# EAGLE design analogBoardV1_5 (EAGLE 6.4)
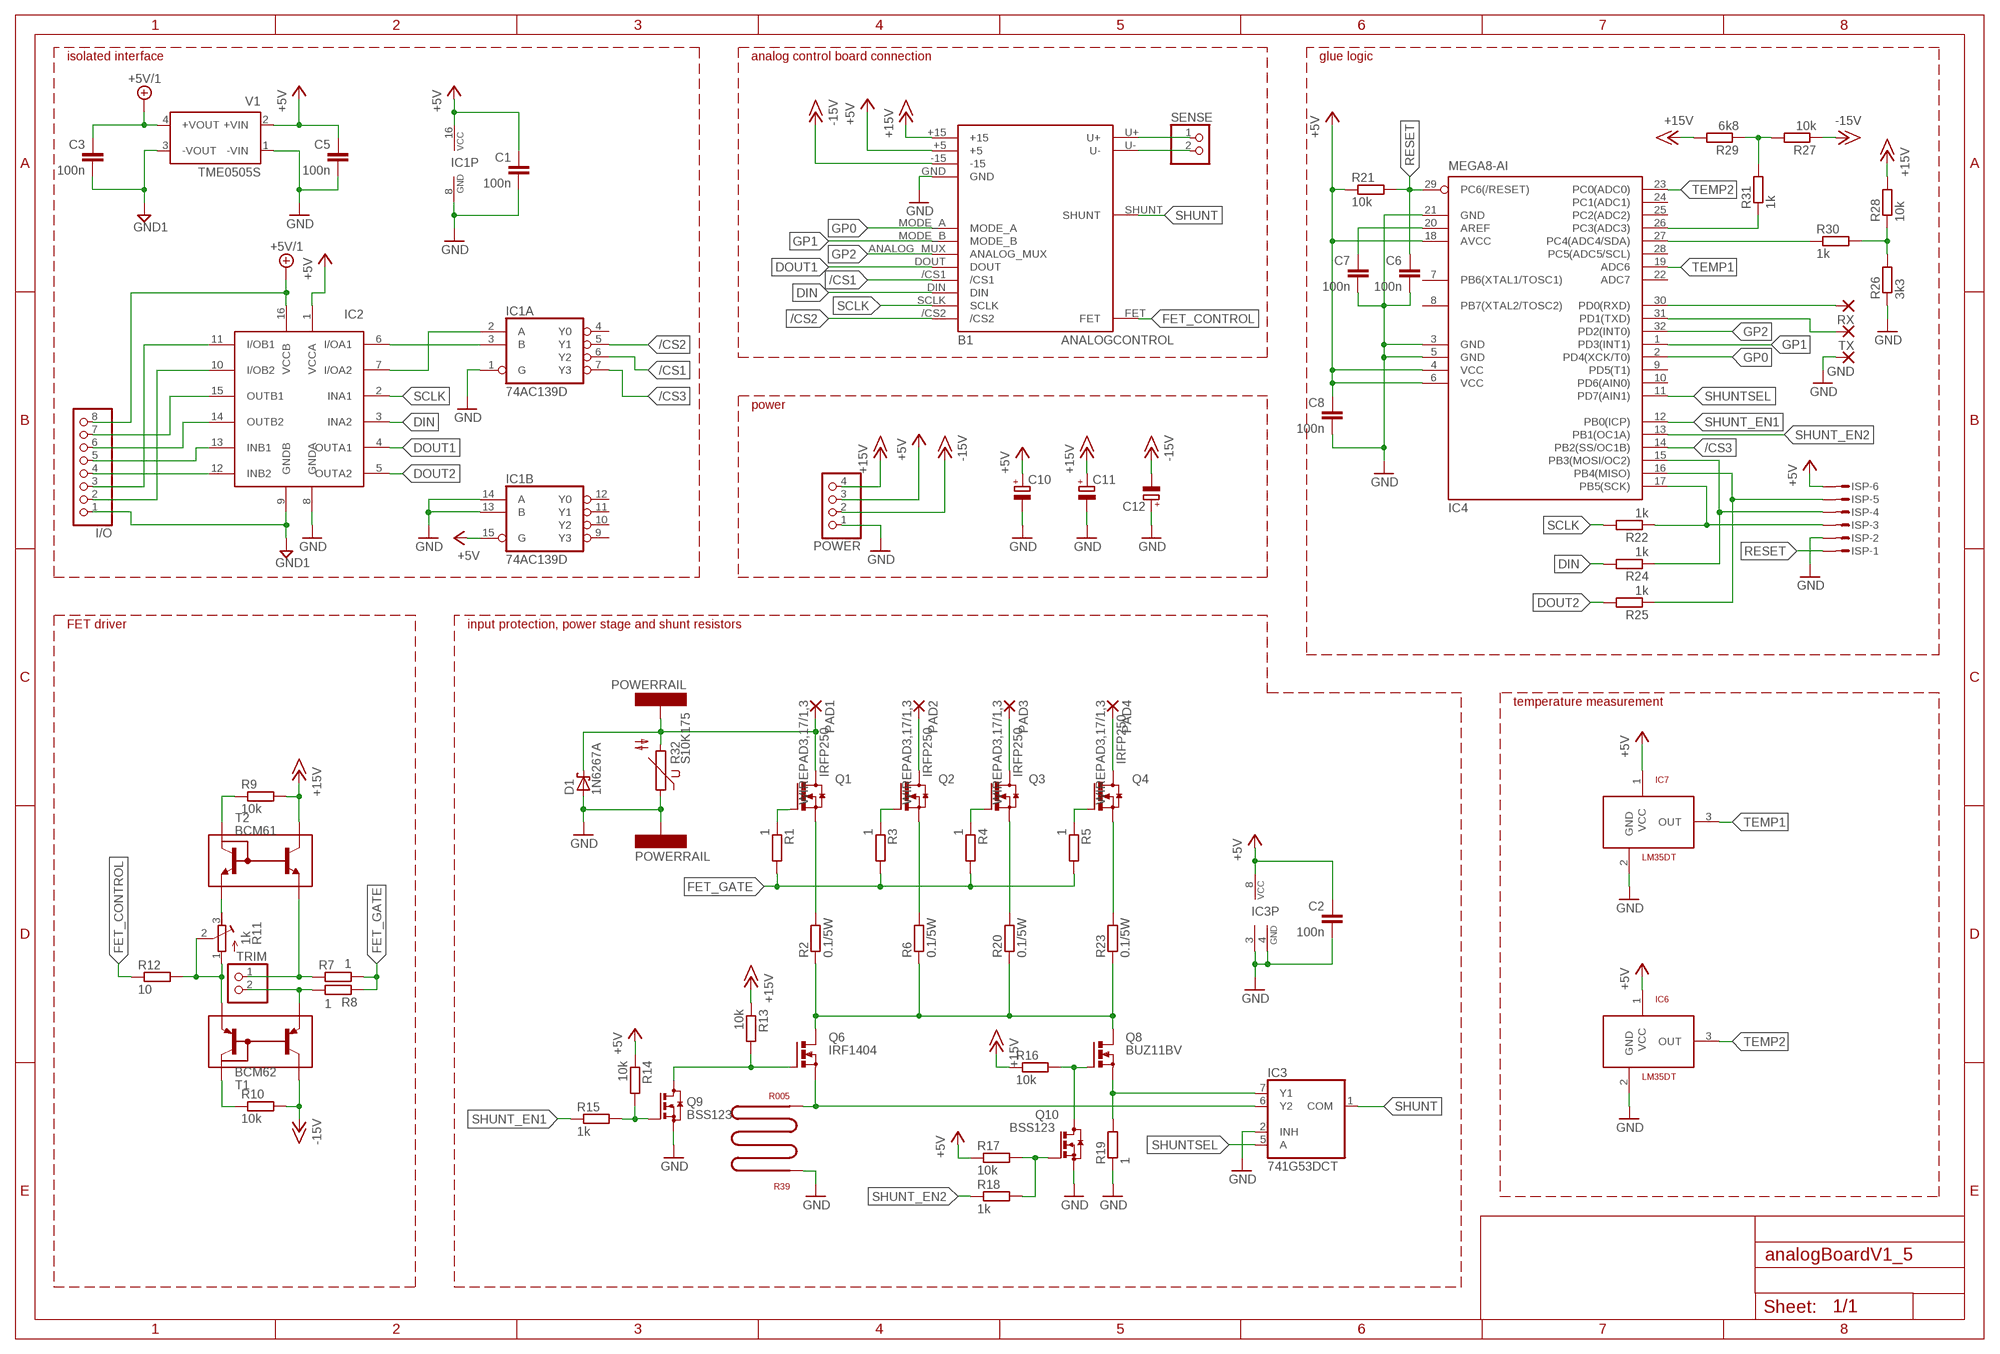
[diagram p0: schematic, sheet 1]

## Parts
B1  ANALOGCONTROL  [ANALOGCONTROL]
C1  100n  C-EUC0603K  [C0603K]
C2  100n  C-EUC0603K  [C0603K]
C3  100n  C-EUC0603K  [C0603K]
C5  100n  C-EUC0603K  [C0603K]
C6  100n  C-EUC0603K  [C0603K]
C7  100n  C-EUC0603K  [C0603K]
C8  100n  C-EUC0603K  [C0603K]
C10  CPOL-EUE2.5-6  [E2,5-6]
C11  CPOL-EUE2.5-6  [E2,5-6]
C12  CPOL-EUE2.5-6  [E2,5-6]
D1  1N6267A  [C4111-15]
GND  SMD2  [SMD1,27-2,54]
I/O  PINHD-1X8  [1X08]
IC1  74AC139D  [SO16]
IC2  MAX14850  [SOIC16N]
IC3  741G53DCT  [DCT_R-PDSO-G8]
IC4  MEGA8-AI  [TQFP32-08]
IC6  LM35DT  [TO220V]
IC7  LM35DT  [TO220V]
ISP  MICROMATCH-6SMF  [MMT-F-SMD-6]
PAD1  WIREPAD3,17/1,3  [3,17/1,3]
PAD2  WIREPAD3,17/1,3  [3,17/1,3]
PAD3  WIREPAD3,17/1,3  [3,17/1,3]
PAD4  WIREPAD3,17/1,3  [3,17/1,3]
POWER  PINHD-1X4  [1X04]
Q1  IRFP250  [TO-247AD-V]
Q2  IRFP250  [TO-247AD-V]
Q3  IRFP250  [TO-247AD-V]
Q4  IRFP250  [TO-247AD-V]
Q6  IRF1404  BUZ11BV  [TO220BV]
Q8  BUZ11BV  [TO220BV]
Q9  BSS123  [SOT23]
Q10  BSS123  [SOT23]
R1  1  R-EU_R0603  [R0603]
R2  0.1/5W  5WAXIALH  [5WAXIAL_H]
R3  1  R-EU_R0603  [R0603]
R4  1  R-EU_R0603  [R0603]
R5  1  R-EU_R0603  [R0603]
R6  0.1/5W  5WAXIALH  [5WAXIAL_H]
R7  1  R-EU_R0603  [R0603]
R8  1  R-EU_R0603  [R0603]
R9  10k  R-EU_R0603  [R0603]
R10  10k  R-EU_R0603  [R0603]
R11  1k  R-TRIMM64W  [RTRIM64W]
R12  10  R-EU_R0603  [R0603]
R13  10k  R-EU_R0603  [R0603]
R14  10k  R-EU_R0603  [R0603]
R15  1k  R-EU_R0603  [R0603]
R16  10k  R-EU_R0603  [R0603]
R17  10k  R-EU_R0603  [R0603]
R18  1k  R-EU_R0603  [R0603]
R19  1  R-EU_0414/15  [0414/15]
R20  0.1/5W  5WAXIALH  [5WAXIAL_H]
R21  10k  R-EU_R0603  [R0603]
R22  1k  R-EU_R0603  [R0603]
R23  0.1/5W  5WAXIALH  [5WAXIAL_H]
R24  1k  R-EU_R0603  [R0603]
R25  1k  R-EU_R0603  [R0603]
R26  3k3  R-EU_R0603  [R0603]
R27  10k  R-EU_R0603  [R0603]
R28  10k  R-EU_R0603  [R0603]
R29  6k8  R-EU_R0603  [R0603]
R30  1k  R-EU_R0603  [R0603]
R31  1k  R-EU_R0603  [R0603]
R32  S10K175  [S10K175]
R39  R005  SHUNTPWR  [PWR4412-2S]
RX  SMD2  [SMD1,27-2,54]
SENSE  PINHD-1X2  [1X02]
T1  BCM62  [SOT143B]
T2  BCM61  [SOT143B]
TRIM  PINHD-1X2  [1X02]
TX  SMD2  [SMD1,27-2,54]
U$1  POWERRAIL  [POWERRAIL]
U$2  POWERRAIL  [POWERRAIL]
V1  TME0505S  [TME]

## Nets
+5V: B1.+5 C1.1 C2.1 C5.1 C8.1 C10.+ IC1.15(B:G) IC1.16(P:VCC) IC2.1(VCCA) IC3.8(VCC) IC4.4(VCC) IC4.6(VCC) IC4.18(AVCC) IC6.1(VCC) IC7.1(VCC) ISP.6 POWER.3 R14.1 R17.1 R21.1 V1.2(+VIN)
+5V/1: C3.1 I/O.8 IC2.16(VCCB) V1.4(+VOUT)
+15V: B1.+15 C11.+ POWER.4 R9.2 R13.1 R16.1 R28.2 R29.2 T2.2
-15V: B1.-15 C12.- POWER.2 R10.2 R27.1 T1.2
/CS1: B1./CS1 IC1.6(A:Y2)
/CS2: B1./CS2 IC1.5(A:Y1)
/CS3: IC1.7(A:Y3) IC4.14(PB2(SS/OC1B))
DIN: B1.DIN IC2.3(INA2) R24.2
DOUT1: B1.DOUT IC2.4(OUTA1)
DOUT2: IC2.5(OUTA2) R25.2
FET_CONTROL: B1.FET R12.1
FET_GATE: R1.2 R3.2 R4.2 R5.2 R7.2 R8.1
GND: B1.GND C1.2 C2.2 C5.2 C6.2 C7.2 C8.2 C10.- C11.- C12.+ D1.A GND.1(P) IC1.1(A:G) IC1.8(P:GND) IC1.13(B:B) IC1.14(B:A) IC2.8(GNDA) IC3.2(INH) IC3.3(GND) IC3.4(GND) IC4.3(GND) IC4.5(GND) IC4.21(GND) IC6.2(GND) IC7.2(GND) ISP.2 POWER.1 Q9.2(S) Q10.2(S) R19.1 R26.1 R32.1 R39.P$1 U$2.1 V1.1(-VIN)
GND1: C3.2 I/O.1 IC2.9(GNDB) V1.3(-VOUT)
GP0: B1.MODE_A IC4.2(PD4(XCK/T0))
GP1: B1.MODE_B IC4.1(PD3(INT1))
GP2: B1.ANALOG_MUX IC4.32(PD2(INT0))
N: Q6.D Q8.D R2.1 R6.1 R20.1 R23.1
N$1: R9.1 T2.1
N$2: Q1.G R1.1
N$3: Q1.S R2.2
N$4: Q4.G R5.1
N$5: Q3.G R4.1
N$6: Q2.G R3.1
N$7: I/O.4 IC2.12(INB2)
N$8: Q2.S R6.2
N$10: R7.1 T2.3 TRIM.1
N$11: R8.2 T1.3 TRIM.2
N$12: R10.1 T1.1
N$13: I/O.5 IC2.13(INB1)
N$14: R11.3(A) T2.4
N$15: I/O.6 IC2.14(OUTB2)
N$16: I/O.7 IC2.15(OUTB1)
N$17: B1.U+ SENSE.1
N$18: Q6.G Q9.3(D) R13.2
N$19: Q3.S R20.2
N$20: R11.1(E) R11.2(S) R12.2 T1.4
N$21: IC1.3(A:B) IC2.6(I/OA1)
N$22: Q9.1(G) R14.2 R15.2
N$23: Q8.G Q10.3(D) R16.2
N$24: Q10.1(G) R17.2 R18.2
N$25: PAD2.1(P) Q2.D
N$26: IC1.2(A:A) IC2.7(I/OA2)
N$27: Q4.S R23.2
N$28: I/O.3 IC2.11(I/OB1)
N$29: I/O.2 IC2.10(I/OB2)
N$30: PAD3.1(P) Q3.D
N$31: C7.1 IC4.20(AREF)
N$32: IC4.30(PD0(RXD)) RX.1(P)
N$33: IC4.31(PD1(TXD)) TX.1(P)
N$34: R26.2 R28.1 R30.2
N$35: R27.2 R29.1 R31.2
N$36: IC4.27(PC4(ADC4/SDA)) R30.1
N$37: IC4.26(PC3(ADC3)) R31.1
N$38: B1.U- SENSE.2
N$63: IC4.15(PB3(MOSI/OC2)) ISP.4 R24.1
N$64: IC4.17(PB5(SCK)) ISP.3 R22.1
N$66: IC4.16(PB4(MISO)) ISP.5 R25.1
POS_INPUT1: PAD4.1(P) Q4.D
RESET: C6.1 IC4.29(PC6(/RESET)) ISP.1 R21.2
SCLK: B1.SCLK IC2.2(INA1) R22.2
SHUNT: B1.SHUNT IC3.1(COM)
SHUNT1: IC3.6(Y2) Q6.S R39.P$2
SHUNT2: IC3.7(Y1) Q8.S R19.2
SHUNT_EN1: IC4.12(PB0(ICP)) R15.1
SHUNT_EN2: IC4.13(PB1(OC1A)) R18.1
SHUNTSEL: IC3.5(A) IC4.11(PD7(AIN1))
TEMP1: IC4.19(ADC6) IC7.3(OUT)
TEMP2: IC4.23(PC0(ADC0)) IC6.3(OUT)
VIN: D1.C PAD1.1(P) Q1.D R32.2 U$1.1
Unconnected: IC1.4(A:Y0) IC1.9(B:Y3) IC1.10(B:Y2) IC1.11(B:Y1) IC1.12(B:Y0) IC4.7(PB6(XTAL1/TOSC1)) IC4.8(PB7(XTAL2/TOSC2)) IC4.9(PD5(T1)) IC4.10(PD6(AIN0)) IC4.22(ADC7) IC4.24(PC1(ADC1)) IC4.25(PC2(ADC2)) IC4.28(PC5(ADC5/SCL))

## Notes on the sheet
- isolated interface | analog control board connection | glue logic
- power
- FET driver | input protection, power stage and shunt resistors
- temperature measurement

## Library data of the parts
B1 = load:ANALOGCONTROL
C1-C3 C5-C8 = rcl:C-EU: CAPACITOR, European symbol
C10-C12 = rcl:CPOL-EU: POLARIZED CAPACITOR, European symbol
D1 = diode:1N6267A: DIODE transient voltage suppressor
GND RX TX = wirepad:SMD2: SMD PAD
I/O = pinhead:PINHD-1X8: PIN HEADER
IC1 = 74xx-eu:74*139: Dual 2-line to 4-line DECODER/DEMULTIPLEXER
IC2 = load:MAX14850
IC3 = 74xx-little-us:74*1G53: SINGLE-POLE DOUBLE-THROW (SPDT) ANALOG SWITCH 2:1 ANALOG MULTIPLEXER/DEMULTIPLEXER Source: http://focus.ti.com/lit/ds/symlink/sn74lvc2g53.pdf
IC4 = atmel:MEGA8: MICROCONTROLLER 8 Kbytes FLASH, 1 kbytes SRAM, 512 bytes EEPROM, USART, 6-channel 10 bit ADC, 2-channel 8 bit ADC Pin compatible with Atmega48, ATMega88, ATMega168 Source: avr.lbr; MPN: ATMEGA8-16AU; OC_FARNELL: 9171371; OC_NEWARK: 73M8863
IC6 IC7 = customSensors:LM35DT
ISP = con-amp-micromatch2:MICROMATCH-6: MicroMaTch 6 7-215464-6 / 0-215464-6 Drawing Number C-215464 DDEController.pdf
PAD1-PAD4 = wirepad:WIREPAD: Wire PAD connect wire on PCB
POWER = pinhead:PINHD-1X4: PIN HEADER
Q1-Q4 = transistor-power:IRFP25*: 33A/27A, 200V/150V, 0.085/0.012 Ohm, N-Channel Power MOSFET Source: Fairchild Semiconductor Corporation
Q6 Q8 = transistor-power:BUZ11: N-CHANNEL MOS FET
Q9 Q10 = transistor-small-signal:BSS123: N-CHANNEL MOS FET
R1 R3-R5 R7-R10 R12-R18 R21 R22 R24-R31 = resistor:R-EU_: RESISTOR, European symbol
R2 R6 R20 R23 = resistormod:5WAXIAL
R11 = resistor:R-TRIMM: Trimm resistor
R19 = rcl:R-EU_: RESISTOR, European symbol
R32 = varistor:S10K175: VARISTOR
R39 = customResistor:SHUNT
SENSE TRIM = pinhead:PINHD-1X2: PIN HEADER
T1 = load:BCM62
T2 = load:BCM61
U$1 U$2 = load:POWERRAIL
V1 = traco-electronic:TME?*: DC/DC Converter TME Series 1 Watt Source: www.tracopower.com .. tme.pdf; MPN: TME 0505S; OC_FARNELL: 1007538; OC_NEWARK: 51R5321

## Board
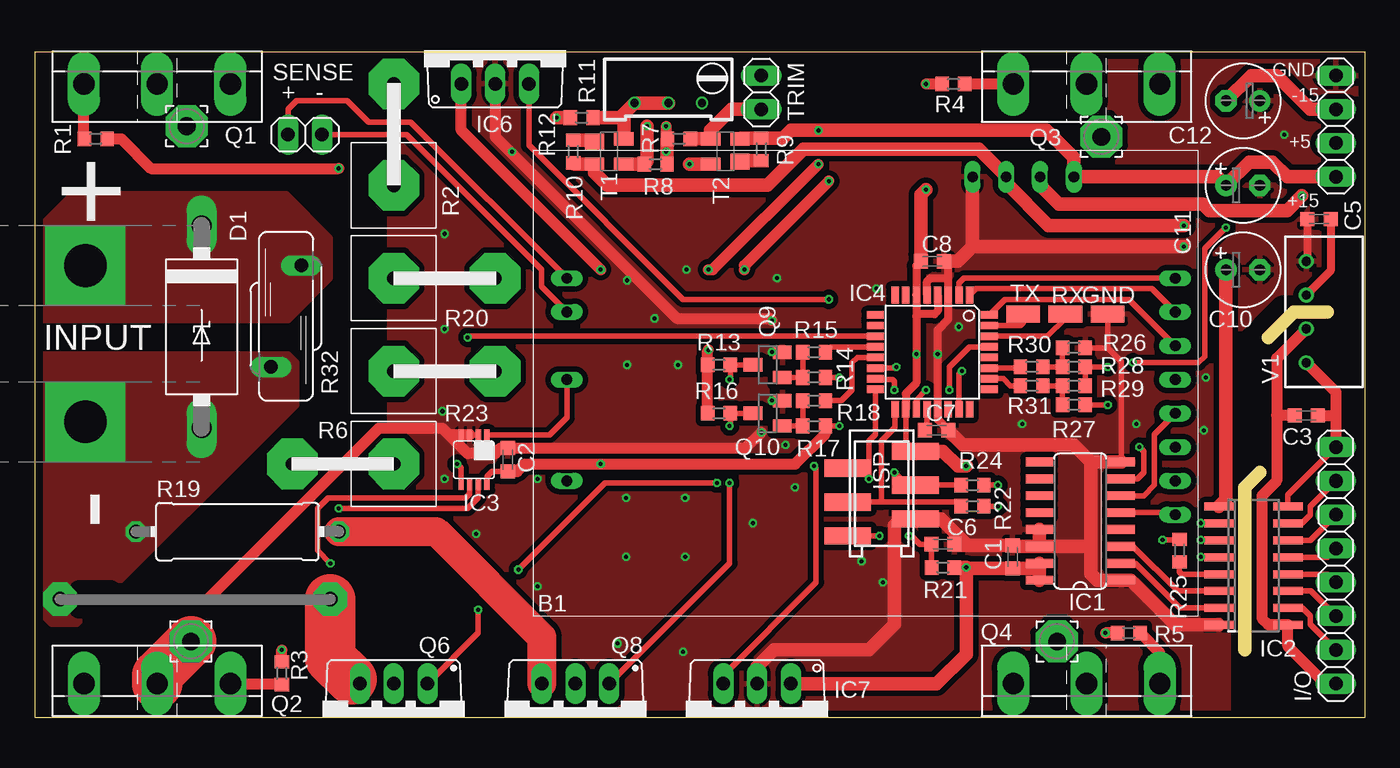
[diagram p1: board, top side]
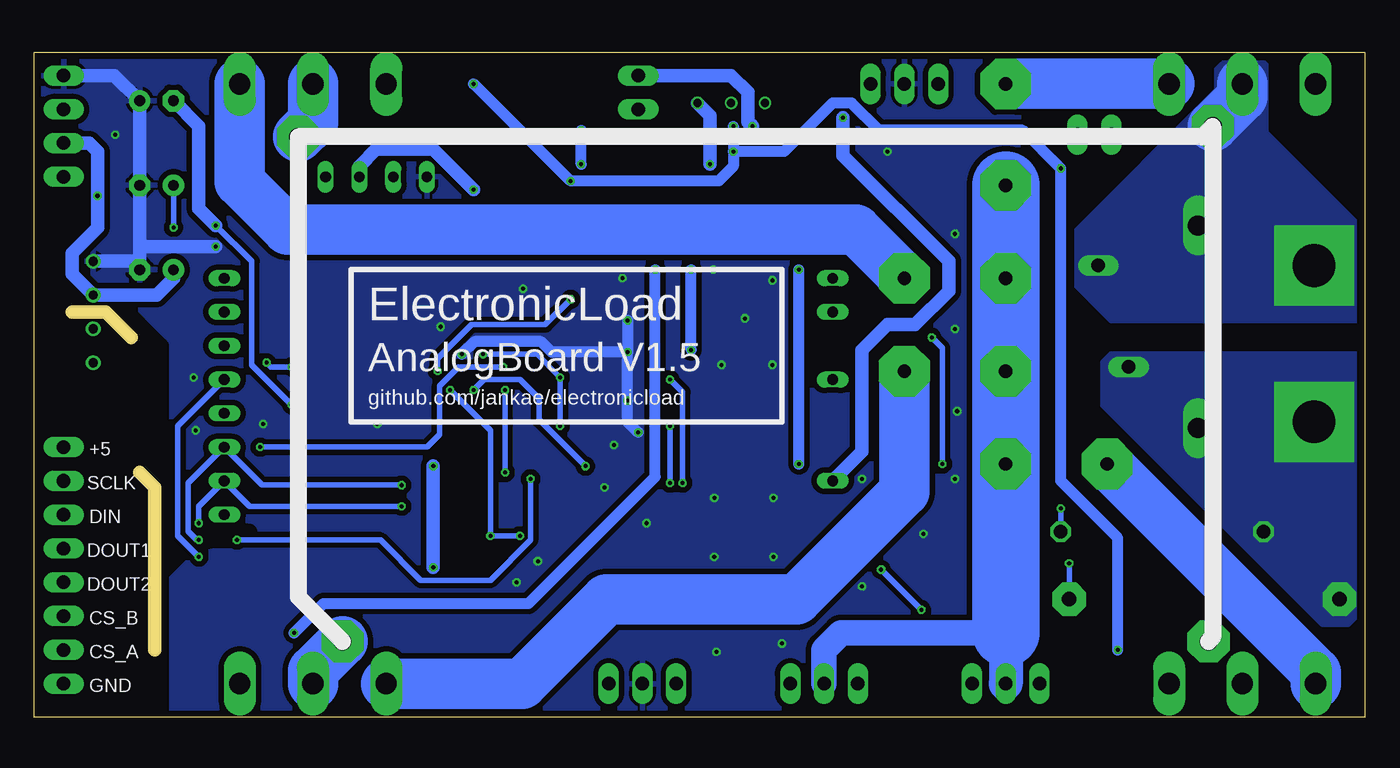
[diagram p2: board, bottom side, seen from below]

Size 100 x 50 mm. Coordinates in mm from the lower left corner, seen from the top.
Outline: 0,0 100,0 100,50 0,50 0,0
Copper layers (1*16): Top 0.035mm / dielectric 1.6mm / Bottom 0.035mm
Design rules "Elecrow_2-layer_PCB_eagle_rule *": minimum track width 6mil, minimum drill 12mil, track to track 6mil, track to pad 6mil, pad to pad 6mil, via to via 8mil, smd to smd 0mil, copper to edge 20mil, drill to drill 10mil, minimum pad ring 6mil, minimum via ring 6mil, stop-mask expansion 0mil, vias tented up to drill 100mil, thermal gap 10mil
tRestrict: area 90.5,0.2 to 99.7,31.1; 2 lines
bRestrict: area 83.8,10.2 to 99.7,14; area 90.5,0.2 to 99.7,31.1
Milling: 4 lines

### Footprints (pad centres in the part's own frame; a part is rotated, then mirrored left to right if it is on the bottom)
ANALOGCONTROL = drill 0.8 long: +5 38.1,33.02; +15 40.64,33.02; -15 35.56,33.02; /CS1 48.26,15.24; /CS2 48.26,7.62; ANALOG_MUX 48.26,20.32; DIN 48.26,12.7; DOUT 48.26,17.78; FET 2.54,10.16; GND 33.02,33.02; MODE_A 48.26,25.4; MODE_B 48.26,22.86; SCLK 48.26,10.16; SHUNT 2.54,17.78; U+ 2.54,25.4; U- 2.54,22.86
C0603K = smd 1.05 x 1.08: 1 -0.875,0; 2 0.875,0
E2,5-6 = drill 0.813 pad 1.6: + -1.27,0 | drill 0.813 pad 1.6 octagon: - 1.27,0
C4111-15 = drill 1.499 long: A 7.62,0; C -7.62,0
SMD1,27-2,54 = smd 1.27 x 2.54: 1 0,0
1X08 = drill 1.016 long: 1 -8.89,0; 2 -6.35,0; 3 -3.81,0; 4 -1.27,0; 5 1.27,0; 6 3.81,0; 7 6.35,0; 8 8.89,0
SO16 = smd 0.66 x 2.032: 1 -4.445,-3.073; 2 -3.175,-3.073; 3 -1.905,-3.073; 4 -0.635,-3.073; 5 0.635,-3.073; 6 1.905,-3.073; 7 3.175,-3.073; 8 4.445,-3.073; 9 4.445,3.073; 10 3.175,3.073; 11 1.905,3.073; 12 0.635,3.073; 13 -0.635,3.073; 14 -1.905,3.073; 15 -3.175,3.073; 16 -4.445,3.073
SOIC16N = smd 0.6 x 2.2: 1 -4.582,-2.6; 2 -3.312,-2.6; 3 -2.042,-2.6; 4 -0.772,-2.6; 5 0.498,-2.6; 6 1.768,-2.6; 7 3.038,-2.6; 8 4.308,-2.6; 9 4.308,2.6; 10 3.038,2.6; 11 1.768,2.6; 12 0.498,2.6; 13 -0.772,2.6; 14 -2.042,2.6; 15 -3.312,2.6; 16 -4.582,2.6
DCT_R-PDSO-G8 = smd 0.4 x 0.8: 1 -0.975,-1.875; 2 -0.325,-1.875; 3 0.325,-1.875; 4 0.975,-1.875; 5 0.975,1.875; 6 0.325,1.875; 7 -0.325,1.875; 8 -0.975,1.875
TQFP32-08 = smd 1.27 x 0.559: 1 -4.293,2.8; 2 -4.293,2; 3 -4.293,1.2; 4 -4.293,0.4; 5 -4.293,-0.4; 6 -4.293,-1.2; 7 -4.293,-2; 8 -4.293,-2.8; 17 4.293,-2.8; 18 4.293,-2; 19 4.293,-1.2; 20 4.293,-0.4; 21 4.293,0.4; 22 4.293,1.2; 23 4.293,2; 24 4.293,2.8 | smd 0.559 x 1.27: 9 -2.8,-4.293; 10 -2,-4.293; 11 -1.2,-4.293; 12 -0.4,-4.293; 13 0.4,-4.293; 14 1.2,-4.293; 15 2,-4.293; 16 2.8,-4.293; 25 2.8,4.293; 26 2,4.293; 27 1.2,4.293; 28 0.4,4.293; 29 -0.4,4.293; 30 -1.2,4.293; 31 -2,4.293; 32 -2.8,4.293
TO220V = drill 1.016 long: 1 -2.54,-2.54; 2 0,-2.54; 3 2.54,-2.54
MMT-F-SMD-6 = smd 1.3 x 3.5: 1 3.175,-2.54; 2 1.905,2.54; 3 0.635,-2.54; 4 -0.635,2.54; 5 -1.905,-2.54; 6 -3.175,2.54
3,17/1,3 = drill 1.321 pad 3.175 octagon: 1 0,0
1X04 = drill 1.016 long: 1 -3.81,0; 2 -1.27,0; 3 1.27,0; 4 3.81,0
TO-247AD-V = drill 1.6 long: D 0,-2.54; G -5.5,-2.54; S 5.5,-2.54
TO220BV = drill 1.016 long: D 0,-2.54; G -2.54,-2.54; S 2.54,-2.54
SOT23 = smd 1 x 1.4: 1 -0.95,-1.1; 2 0.95,-1.1; 3 0,1.1
R0603 = smd 1 x 1.1: 1 -0.85,0; 2 0.85,0
5WAXIAL_H = drill 1 pad 3.81 octagon: 1 0,0; 2 -7.62,0
RTRIM64W = drill 0.61: 1 1.27,-2.54; 2 1.27,0; 3 1.27,2.54
0414/15 = drill 1.016 octagon: 1 -7.62,0; 2 7.62,0
S10K175 = drill 1.016 long: 1 -1.143,-3.81; 2 1.143,3.81
PWR4412-2S = drill 1.1 pad 2.54 octagon: P$1 -10.16,0; P$2 10.16,0
1X02 = drill 1.016 long: 1 -1.27,0; 2 1.27,0
SOT143B = smd 1.2 x 1.44: 1 -0.75,-1.1 | smd 1 x 1.44: 2 0.95,-1.1; 3 0.95,1.1; 4 -0.95,1.1
POWERRAIL = drill 3.2 pad 6 square: 1 0,0
TME = drill 0.7 pad 1.1: 1 -3.81,0; 2 -1.27,0; 3 1.27,0; 4 3.81,0

### Placement (x,y rotation side)
B1  37.47,7.62 0 top
C1  73.5,12.06 90 top
C2  35.56,19.37 90 top
C3  95.57,22.7 180 top
C5  96.52,37.47 180 top
C6  68.26,13.02 0 top
C7  67.79,21.59 0 top
C8  67.47,34.29 0 top
C10  90.81,33.66 0 top
C11  90.81,40.01 0 top
C12  90.81,46.35 180 top
D1  12.54,29.37 270 top
GND  80.64,30.32 90 top
I/O  97.79,11.43 90 top
IC1  78.58,14.76 90 top
IC2  91.6,11.27 270 top
IC3  33.02,19.37 180 top
IC4  67.47,27.46 270 top
IC6  34.61,50.16 0 top
IC7  54.29,0 180 top
ISP  63.66,16.83 270 top
PAD1  11.43,44.45 0 top
PAD2  11.75,5.71 0 top
PAD3  80.17,43.66 0 top
PAD4  76.83,5.71 0 top
POWER  97.79,44.45 270 top
Q1  9.21,50.16 0 top
Q2  9.21,0 180 top
Q3  79.06,50.16 0 top
Q4  79.06,0 180 top
Q6  26.99,0 180 top
Q8  40.64,0 180 top
Q9  55.09,26.51 90 top
Q10  55.09,22.86 90 top
R1  4.6,43.5 0 top
R2  26.99,40.01 270 top
R3  18.57,3.33 90 top
R4  69.06,47.62 180 top
R5  82.23,6.35 180 top
R6  26.99,19.05 0 top
R7  48.42,43.5 180 top
R8  46.67,41.59 180 top
R9  54.61,42.7 90 top
R10  40.48,42.55 270 top
R11  47.62,47.47 270 top
R12  41.12,45.09 0 top
R13  51.44,26.51 0 top
R14  58.58,25.56 180 top
R15  58.58,27.46 180 top
R16  51.44,22.86 0 top
R17  58.58,21.91 180 top
R18  58.58,23.81 180 top
R19  15.24,13.97 0 top
R20  26.99,33.02 180 top
R21  68.26,11.27 180 top
R22  70.48,15.88 0 top
R23  26.99,26.04 180 top
R24  70.48,17.46 0 top
R25  86.04,12.54 270 top
R26  78.11,27.78 180 top
R27  78.11,23.5 180 top
R28  78.11,26.35 0 top
R29  78.11,24.92 0 top
R30  74.93,26.35 0 top
R31  74.93,24.92 0 top
R32  18.89,30.16 0 top
R39  12.06,8.89 0 top
RX  77.47,30.32 90 top
SENSE  20.32,43.81 0 top
T1  43.18,42.55 270 top
T2  51.91,42.55 90 top
TRIM  54.61,46.99 90 top
TX  74.3,30.32 90 top
U$1  3.81,33.97 0 top
U$2  3.81,22.23 0 top
V1  95.57,30.48 270 top

### Tracks (layer width: path | path; a pad name or v marks a point on that pad's centre or on a via)
+5V  (via drill 0.3)
  Top 0.406: IC3.8 33.99,18.12 34.37,18.49 C2.1 | IC4.18 65.47,20.73 ISP.6 | R14.1 v60.48,25.56 | v60.48,21.91 R17.1
  Top 0.61: C5.1 97.39,33.58 V1.2 | C8.1 66.27,33.97 IC4.6 66.27,30.16 | 66.27,30.16 v66.27,27.3 66.27,25.15 65.47,24.35 IC4.18 | IC4.4 67.87,30.56 67.63,30.32 66.43,30.32 66.27,30.16
  Top 0.813: C2.1 36.27,18.49 36.83,19.05 v42.55,19.05 57.15,19.05 59.43,21.33 R17.1 | v42.55,33.66 32.07,44.13 IC6.1
  Top 1.016: IC2.1 89.53,16.39 C10.+ | IC1.16 75.51,10.95 | 75.51,10.95 IC1.15 | 75.51,10.95 75.27,11.19 C1.1 69.19,11.19 R21.1 v70.01,11.27 70.01,4.76 67.79,2.54 IC7.1 | C8.1 66.59,39.29 v66.99,39.69 | B1.+5 75.56,40.01 76.99,38.58 87.79,38.58 88.27,38.1 94.14,38.1 v95.25,39.21 | v70.01,18.89 69.37,18.89 68.26,20 ISP.6
  Bottom 0.406: v60.48,21.91 v60.48,25.56 62.23,27.3 v66.27,27.3
  Bottom 0.813: v42.55,19.05 v42.55,33.66
  Bottom 1.016: POWER.3 95.89,43.18 95.25,42.55 v95.25,39.21 95.25,36.83 97.16,34.92 97.16,33.34 V1.2 90.81,31.75 89.53,33.02 C10.+ | v66.99,39.69 70.01,42.7 74.3,42.7 75.56,41.43 B1.+5 | v70.01,11.27 v70.01,18.89
+5V/1
  Top 0.406: IC2.16 94.2,16.73 I/O.8
  Top 0.813: V1.4 97.79,24.45 97.79,22.7 | 97.79,22.7 I/O.8 | C3.1 97.79,22.7
+15V  (via drill 0.3)
  Top 0.406: R29.2 R28.2 v80.64,26.35 | v82.55,26.67 87.47,26.67 87.95,27.15 87.95,35.24 v89.53,36.83
  Top 0.813: R16.1 R13.1 50.59,27.57 v50.64,27.62 | v50.64,33.66 50.96,33.66 v58.9,41.59
  Top 1.016: POWER.4 94.14,40.64 93.03,41.75 91.28,41.75 C11.+ 88.9,40.64 B1.+15 78.11,42.07 76.04,44.13 v58.9,44.13 56.83,44.13 56.25,43.55 R9.2 53.07,43.55 T2.2
  Bottom 0.406: v80.64,26.35 82.23,26.35 v82.55,26.67 | v89.53,36.83 C11.+
  Bottom 0.813: v50.64,27.62 v50.64,33.66 | v58.9,41.59 v58.9,44.13
-15V  (via drill 0.3)
  Top 0.406: R27.1 v80.64,23.5
  Top 1.016: v86.36,36.99 76.2,36.99 73.03,40.16 B1.-15 70.96,42.7 57.78,42.7 55.09,40.01 43.02,40.01 42.07,40.96 T1.2 40.58,41.59 R10.2 | POWER.2 95.89,45.72 93.34,48.26 91.44,48.26 C12.-
  Bottom 0.406: v80.64,23.5 83.66,26.51 83.66,34.29 v86.36,36.99
  Bottom 1.016: v86.36,36.99 87.63,38.26 87.63,44.45 C12.-
/CS1
  Top 0.406: IC1.6 83.34,16.67 84.14,17.46 84.14,21.27 B1./CS1
/CS2
  Top 0.406: IC1.5 85.57,15.4 B1./CS2
/CS3  (via drill 0.3)
  Top 0.406: IC1.7 82.87,17.94 83.34,18.41 83.34,20 v83.03,20.32 | v64.77,26.35 64.68,26.26 IC4.14
  Bottom 0.406: v83.03,20.32 70.48,20.32 69.53,21.27 69.53,24.92 68.1,26.35 v64.77,26.35
DIN  (via drill 0.3)
  Top 0.406: IC2.3 88.98,13.34 v87.63,13.34 | R24.2 v72.39,17.46
  Bottom 0.406: v87.63,13.34 87.79,13.34 88.42,13.97 88.42,17.62 B1.DIN 82.87,17.46 v72.39,17.46
DOUT1  (via drill 0.3)
  Top 0.406: IC2.4 88.98,12.06 v87.63,12.06
  Bottom 0.406: B1.DOUT 89.22,21.91 89.22,13.65 v87.63,12.06
DOUT2
  Top 0.406: IC2.5 86.22,10.77 86.04,10.95 R25.2
FET_CONTROL  (via drill 0.3)
  Top 1.016: v39.21,45.09 R12.1
  Bottom 1.016: B1.FET 37.78,20 37.78,27.62 35.88,29.53 33.81,29.53 31.27,32.07 31.27,34.29 39.21,42.23 v39.21,45.09
FET_GATE  (via drill 0.3)
  Top 0.406: 47.47,43.4 47.52,43.4 R8.1
  Top 0.813: v66.99,47.62 R4.2 | R5.2 v80.49,6.35 | R3.2 v18.57,5.08 | R1.2 6.51,43.5 8.73,41.27 v22.86,41.27 | v47.47,44.45 47.47,43.4 v47.47,42.55 | v59.69,40.32 53.34,33.97 v53.34,33.66
  Top 1.016: R8.1 47.52,43.45 R7.2
  Bottom 0.813: v47.47,42.55 47.47,41.43 48.58,40.32 v59.69,40.32 v66.99,47.62 | v80.49,6.35 78.26,8.57 62.87,8.57 53.34,18.1 v53.34,33.66 | v18.57,5.08 18.57,13.49 22.86,17.78 v22.86,41.27 25.72,44.13 36.51,44.13 38.58,46.2 40.01,46.2 43.66,42.55 v47.47,42.55 | v47.47,44.45 v47.47,42.55
GND  (via drill 0.3)
  Top 0.406: 33.34,21.23 IC3.2 IC3.3 | Q10.2 v55.41,23.81 v55.4,23.81 | GND.1 80.64,27.78 | R26.1 80.64,27.78 | 80.64,27.78 81.66,26.77 IC1.8 | v55.4,27.46 Q9.2 v55.41,27.46 v55.4,27.46
  Top 0.61: C5.2 95.64,34.37 V1.1 | 68.67,33.18 IC4.3 68.67,29.93 67.87,29.13 v67.87,27.3 IC4.21 67.87,22.38 C7.2 | 68.67,33.18 68.67,33.97 C8.2 | IC4.5 67.07,32.78 67.31,33.02 68.51,33.02 68.67,33.18
  Top 0.813: v54.61,21.43 53.42,20.24 C2.2 35.01,20.24 34.61,19.84 32.54,19.84 31.14,21.24 | R39.P$1 13.02,8.89 25.88,21.75 30.64,21.75 31.14,21.24 | IC3.3 31.14,21.24 | IC6.2 34.61,43.66 48.26,30 55.24,30 v55.4,29.84
  Top 1.016: B1.GND 70.48,35.4 | 70.48,35.4 v86.36,35.4 | IC2.8 85.75,6.96 82.39,10.32 IC1.1 79.85,10.32 79.38,10.79 79.38,12.86 | 79.38,12.86 79.38,19.05 79.45,19.13 | IC1.14 73.58,12.86 C1.2 70.09,12.94 | IC1.14 79.38,12.86 | IC1.13 IC1.14 | IC1.8 79.53,19.21 79.45,19.13 | 70.09,12.94 68.1,14.92 ISP.2 65.09,14.92 64.61,14.45 64.61,6.99 62.71,5.08 55.56,5.08 54.29,3.81 IC7.2 | C8.2 69.37,34.29 70.48,35.4 | C6.2 69.22,12.94 70.09,12.94 | C7.2 69.77,20.48 78.11,20.48 79.45,19.13
  Bottom 0.813: v55.4,27.46 v55.4,23.81 55.4,22.23 v54.61,21.43 | v55.4,27.46 61.12,27.46 61.91,28.26 66.92,28.26 v67.87,27.3 | v55.4,29.84 v55.4,27.46
  Bottom 1.016: POWER.1 93.98,48.26 C12.+ C11.- 92.08,35.4 | 92.08,35.4 92.08,34.29 | 92.08,34.29 C10.- | V1.1 92.08,34.29 | v86.36,35.4 92.08,35.4
  other vias: 93.9,43.81 88.03,25.56 87.87,21.59 82.79,22.07 74.22,22.07 69.46,29.37 63.27,32.23 55.8,33.02 56.44,20.48 63.74,10.16 62.15,11.75 48.98,33.66 44.53,32.86 46.6,30 44.53,26.51 48.34,26.51 44.45,16.51 48.9,16.51 48.9,12.06 44.45,12.06 53.98,14.61 57.15,17.3 48.74,4.92 43.82,5.56 37.79,9.84 37.79,17.94 33.18,13.81 30.8,17.94 30.64,23.02 30.8,29.21 30.8,36.35 35.88,42.55
  pour Bottom (isolate 0.61, no thermals): 0.64,27.3 19.05,27.3 19.68,26.67 19.68,23.5 3.17,6.99 1.27,6.99 0.64,7.62
  pour Top (isolate 0.61, no thermals): 0.64,27.3 19.05,27.3 19.68,26.67 19.68,23.5 3.17,6.99 1.27,6.99 0.64,7.62
  pour Bottom (isolate 0.406): 26.04,51.44 100.97,51.44 100.97,-0.64 26.04,-0.64
  pour Top (isolate 0.406): 26.67,50.64 101.6,50.64 101.6,-1.27 26.67,-1.27
GND1
  Top 0.813: V1.3 93.34,26.99 93.34,22.7 | 93.34,22.7 93.34,17.78 92.23,16.67 92.23,7.46 92.71,6.99 94.18,6.99 IC2.9 94.2,5.34 97,2.54 I/O.1 | C3.2 93.34,22.7
GP0
  Top 0.406: IC4.2 69.47,32.64 69.85,33.02 B1.MODE_A
GP1
  Top 0.406: IC4.1 70.74,32.23 83.98,32.23 B1.MODE_B
GP2
  Top 0.406: IC4.32 72.93,31.43 82.23,31.43 B1.ANALOG_MUX
N
  Bottom 1.93: Q8.D 40.64,5.08 39.37,6.35 26.99,6.35
  Bottom 2.54: 26.99,6.35 Q6.D
  Bottom 5.08: R2.1 R20.1 R23.1 R6.1 26.99,6.35
N$1
  Top 1.016: T2.1 53.07,41.85 R9.1
N$2
  Top 0.813: R1.1 3.71,43.54 Q1.G
N$3
  Bottom 3.81: R2.2 Q1.S
N$4
  Top 0.813: R5.1 84.56,4.88 Q4.G
N$5
  Top 0.813: R4.1 Q3.G
N$6
  Top 0.813: R3.1 14.76,2.48 Q2.G
N$7
  Top 0.406: IC2.12 97.18,10.77 I/O.4
N$8
  Bottom 3.81: Q2.S 3.71,3.39 R6.2
N$10
  Top 1.016: R7.1 T2.3 50.81,44.14 52.39,45.72 TRIM.1
N$11  (via drill 0.3)
  Top 1.016: T1.3 R8.2 46.04,41.81 v46.04,44.45
  Bottom 1.016: v46.04,44.45 46.35,44.77 46.35,46.99 47.62,48.26 TRIM.2
N$12
  Top 1.016: T1.1 41.98,43.4 R10.1
N$13
  Top 0.406: IC2.13 97.13,12.04 I/O.5
N$14  (via drill 0.3)
  Top 1.016: T2.4 v49.22,41.59 v49.21,41.59
  Bottom 1.016: v49.21,41.59 49.21,45.24 R11.3
N$15
  Top 0.406: IC2.14 95.86,13.31 I/O.6
N$16
  Top 0.406: IC2.15 95.23,14.58 95.89,15.24 95.89,15.88 I/O.7
N$17
  Top 0.406: SENSE.1 19.05,45.72 19.68,46.35 23.5,46.35 25.08,44.77 28.26,44.77 B1.U+
N$18  (via drill 0.3)
  Top 0.406: Q9.3 R13.2 52.28,25.46 v52.23,25.4 | Q6.G 33.34,6.35 v33.34,8.1 | v36.35,11.11 42.86,17.62 v51.28,17.62
  Bottom 0.406: v33.34,8.1 v36.35,11.11 | v51.28,17.62 51.28,24.45 v52.23,25.4
N$19
  Bottom 3.81: R20.2 38.26,36.67 80.96,36.67 84.56,40.27 Q3.S
N$20
  Top 1.016: T1.4 44.28,45.09 | R11.2 R11.1 44.28,45.39 44.28,45.24 44.28,45.09 | R12.2 44.28,45.09
N$21
  Top 0.406: IC2.6 85.91,9.5 82.55,12.86 IC1.3
N$22
  Top 0.406: Q9.1 R14.2 R15.2
N$23  (via drill 0.3)
  Top 0.406: Q10.3 R16.2 52.28,21.96 v52.23,21.91 | Q8.G 52.23,11.59 v52.23,17.62
  Bottom 0.406: v52.23,17.62 v52.23,21.91
N$24
  Top 0.406: Q10.1 R17.2 R18.2
N$25
  Top 3.81: Q2.D 9.21,3.17 PAD2.1
N$26
  Top 0.406: IC2.7 86.06,8.23 82.71,11.59 IC1.2
N$27
  Bottom 3.81: R23.2 34.61,16.99 42.7,8.89 56.99,8.89 63.34,2.54 Q4.S
N$28
  Top 0.406: IC2.11 95.91,9.5 I/O.3
N$29
  Top 0.406: IC2.10 95.27,8.23 95.89,7.62 95.89,6.99 I/O.2
N$30
  Bottom 3.81: Q3.D 79.06,44.77 PAD3.1
N$31
  Top 0.406: IC4.20 67.07,21.75 C7.1
N$32
  Top 0.406: IC4.30 76.13,28.66 77.47,30 RX.1
N$33
  Top 0.406: IC4.31 74.07,29.46 74.3,29.69 TX.1
N$34
  Top 0.406: R30.2 R28.1 R26.2
N$35
  Top 0.406: R31.2 R29.1 R27.2
N$36
  Top 0.406: IC4.27 73.99,26.26 R30.1
N$37
  Top 0.406: IC4.26 72.8,25.46 73.34,24.92 R31.1
N$38
  Top 0.406: SENSE.2 27.94,43.81 38.1,33.66 38.1,32.38 B1.U-
N$63  (via drill 0.3)
  Top 0.406: IC4.15 63.24,25.4 64.45,25.4 64.61,25.24 v64.61,24.61 | R24.1 ISP.4 65.56,17.46 v64.61,18.41
  Bottom 0.406: v64.61,18.41 v64.61,24.61
N$64
  Top 0.406: IC4.17 64.67,21.81 63.66,20.8 63.66,16.19 | 63.66,16.19 ISP.3 | R22.1 69.32,16.19 63.66,16.19
N$66  (via drill 0.3)
  Top 0.406: IC4.16 63.18,21.27 62.71,20.8 62.71,19.05 | 62.71,19.05 62.39,18.73 ISP.5 | 62.71,19.05 v62.71,17.94 | v84.77,13.34 85.99,13.34 R25.1
  Bottom 0.406: v62.71,17.94 62.71,13.34 65.72,10.32 70.96,10.32 73.98,13.34 v84.77,13.34
POS_INPUT1
  Bottom 3.81: Q4.D 79.06,3.49 PAD4.1
RESET  (via drill 0.3)
  Top 0.406: R21.2 67.41,12.99 C6.1 66.52,13.02 65.88,13.65 v65.72,13.65 | IC4.29 70.25,27.86 68.74,26.35 v68.74,24.61 | v63.5,13.65 ISP.1
  Bottom 0.406: v68.74,24.61 65.72,21.59 v65.72,13.65 v63.5,13.65
SCLK  (via drill 0.3)
  Top 0.406: IC2.2 87.65,14.58 v87.63,14.61 | R22.2 v72.39,15.88
  Bottom 0.406: v87.63,14.61 87.63,15.88 B1.SCLK 83.82,15.88 v72.39,15.88
SHUNT
  Top 0.406: IC3.1 38.7,21.24 40.01,22.54 B1.SHUNT
SHUNT1  (via drill 0.3)
  Top 0.406: IC3.6 32.7,16.82 32.38,16.51 22.07,16.51 21.27,15.72 21.27,12.54 v22.23,11.59
  Top 2.184: 23.81,2.86 24.13,2.86 Q6.S
  Top 3.81: R39.P$2 22.23,4.45 23.81,2.86
  Bottom 0.406: v22.23,11.59 R39.P$2
SHUNT2  (via drill 0.3)
  Top 0.406: IC3.7 33.34,16.52 32.54,15.72 v22.86,15.72
  Top 2.184: R19.2 30.16,13.97 38.1,6.03 Q8.S
  Bottom 0.406: v22.86,15.72 R19.2
SHUNT_EN1
  Top 0.406: R15.1 59.83,27.86 IC4.12
SHUNT_EN2
  Top 0.406: R18.1 60.64,23.81 61.44,24.61 61.44,26.67 61.83,27.06 IC4.13
SHUNTSEL  (via drill 0.3)
  Top 0.406: IC4.11 32.63,28.66 v32.54,28.57 | IC3.5 32.05,18.75 v31.75,19.05
  Bottom 0.406: v31.75,19.05 31.75,27.78 v32.54,28.57
TEMP1  (via drill 0.3)
  Top 0.406: IC7.3 51.75,3.17 58.74,10.16 58.74,18.73 v58.58,18.89 | v66.99,24.61 66.27,23.88 IC4.19
  Bottom 0.406: v66.99,24.61 66.2,25.4 63.5,25.4 62.07,23.97 62.07,22.38 v58.58,18.89
TEMP2  (via drill 0.3)
  Top 0.406: IC4.23 69.47,25.81 v69.69,26.04 | v59.69,31.43 48.74,31.43 37.15,43.02 IC6.3
  Bottom 0.406: v69.69,26.04 69.69,26.99 67.15,29.53 61.59,29.53 v59.69,31.43
VIN
  Bottom 3.81: Q1.D 9.21,46.67 PAD1.1
  pour Top (isolate 0.61, no thermals): 0.64,29.84 19.05,29.84 22.23,33.02 22.23,36.04 18.89,39.37 2.86,39.37 0.64,37.15
  pour Bottom (isolate 0.61, no thermals): 0.64,29.84 19.05,29.84 22.23,33.02 22.23,36.04 11.11,47.15 11.11,48.74 10.32,49.53 7.94,49.53 7.46,49.05 7.46,43.97 0.64,37.15

### Text on the board
tPlace: GND | -15 | + | - | +5 | +15 | + | INPUT | -
bPlace: ElectronicLoad | AnalogBoard V1.5 | github.com/jankae/electronicload | +5 | SCLK | DIN | DOUT1 | DOUT2 | CS_B | CS_A | GND